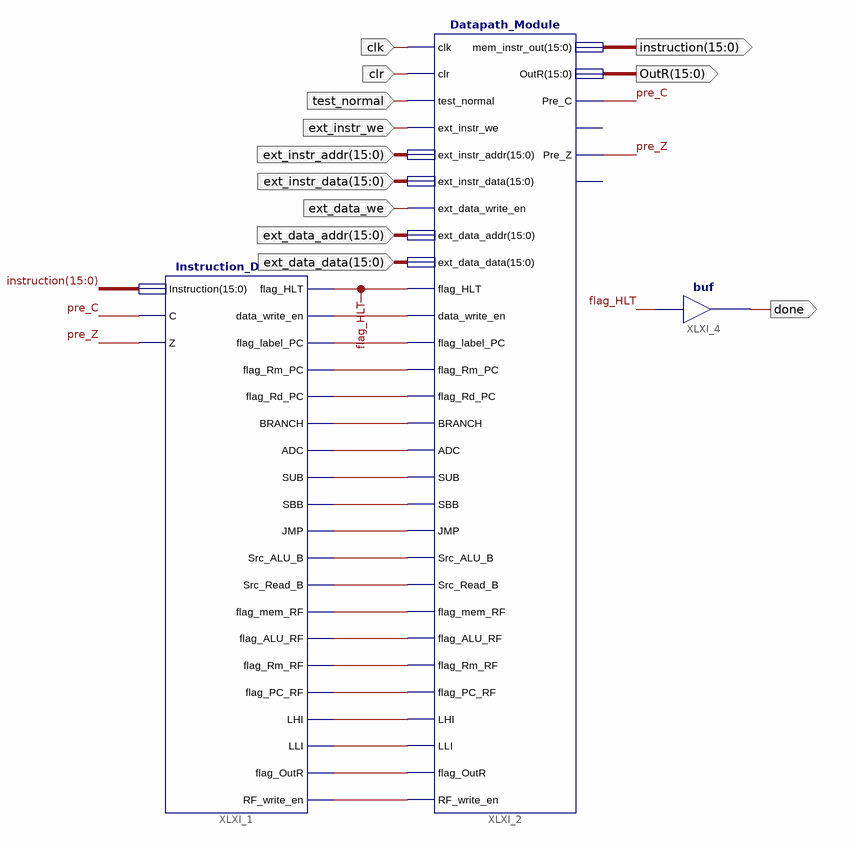
[diagram p0: schematic sheet 1]
// Xilinx ISE schematic Single_Cycle_RISC.sch (virtex6) as structural Verilog: 3 symbols, 12 ports
module Single_Cycle_RISC (
  input  clk,
  input  clr,
  input  test_normal,
  input  ext_instr_we,
  input  [15:0] ext_instr_addr,
  input  [15:0] ext_instr_data,
  input  ext_data_we,
  input  [15:0] ext_data_addr,
  input  [15:0] ext_data_data,
  output [15:0] instruction,
  output [15:0] OutR,
  output done
);

  wire flag_HLT, pre_C, pre_Z, XLXN_2, XLXN_3, XLXN_4, XLXN_5, XLXN_6, XLXN_7, XLXN_8, XLXN_9, XLXN_10,
       XLXN_11, XLXN_12, XLXN_13, XLXN_14, XLXN_15, XLXN_16, XLXN_17, XLXN_18, XLXN_24, XLXN_25;

  Instruction_Decode XLXI_1 (
    .Instruction(instruction), .C(pre_C), .Z(pre_Z), .flag_HLT(flag_HLT), .data_write_en(XLXN_2),
    .flag_label_PC(XLXN_3), .flag_Rm_PC(XLXN_4), .flag_Rd_PC(XLXN_5), .BRANCH(XLXN_6), .ADC(XLXN_7),
    .SUB(XLXN_8), .SBB(XLXN_9), .JMP(XLXN_10), .Src_ALU_B(XLXN_11), .Src_Read_B(XLXN_12),
    .flag_mem_RF(XLXN_13), .flag_ALU_RF(XLXN_14), .flag_Rm_RF(XLXN_15), .flag_PC_RF(XLXN_16), .LHI(XLXN_17),
    .LLI(XLXN_18), .RF_write_en(XLXN_25), .flag_OutR(XLXN_24));
  Datapath_Module XLXI_2 (
    .clk(clk), .clr(clr), .test_normal(test_normal), .ext_instr_we(ext_instr_we),
    .ext_instr_addr(ext_instr_addr), .ext_instr_data(ext_instr_data), .ext_data_write_en(ext_data_we),
    .ext_data_addr(ext_data_addr), .ext_data_data(ext_data_data), .flag_HLT(flag_HLT),
    .data_write_en(XLXN_2), .flag_label_PC(XLXN_3), .flag_Rm_PC(XLXN_4), .flag_Rd_PC(XLXN_5),
    .BRANCH(XLXN_6), .ADC(XLXN_7), .SUB(XLXN_8), .SBB(XLXN_9), .JMP(XLXN_10), .Src_ALU_B(XLXN_11),
    .Src_Read_B(XLXN_12), .flag_mem_RF(XLXN_13), .flag_OutR(XLXN_24), .RF_write_en(XLXN_25),
    .flag_ALU_RF(XLXN_14), .flag_Rm_RF(XLXN_15), .flag_PC_RF(XLXN_16), .LHI(XLXN_17), .LLI(XLXN_18),
    .mem_instr_out(instruction), .OutR(OutR), .Pre_C(pre_C), .Pre_Z(pre_Z));  // open: Pre_V, Pre_N
  buf XLXI_4 (done, flag_HLT);
endmodule
